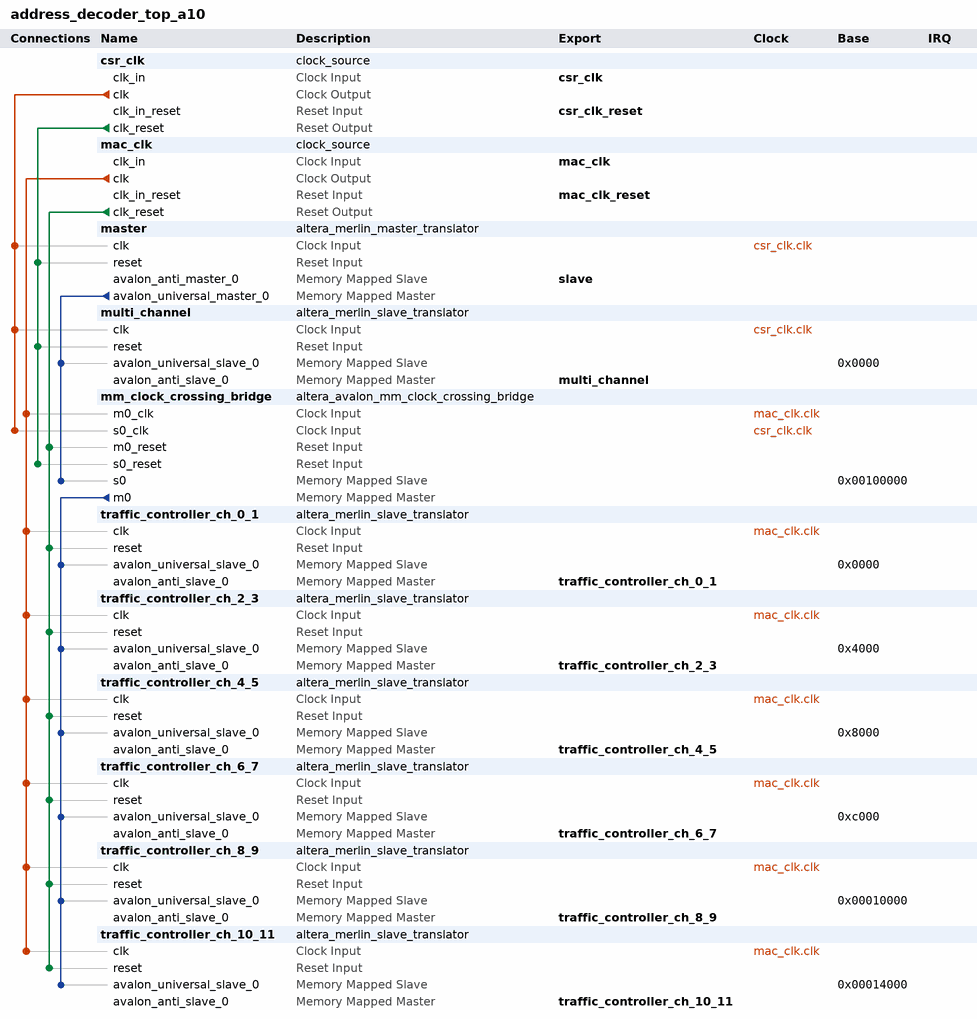
[diagram p0: system contents]
# Platform Designer (Qsys) system address_decoder_top_a10, Arria 10 10AX115S4F45I3SGE2
# Parameters at their usual value, and those the tool derives, are not listed.
package require -exact qsys 16.0
create_system address_decoder_top_a10
set_project_property DEVICE_FAMILY {Arria 10}
set_project_property DEVICE 10AX115S4F45I3SGE2

add_instance csr_clk clock_source 16.0
set_instance_parameter_value csr_clk clockFrequency 125000000

add_instance mac_clk clock_source 16.0
set_instance_parameter_value mac_clk clockFrequency 156250000

add_instance master altera_merlin_master_translator 16.0
set_instance_parameter_value master AV_ADDRESSGROUP 0
set_instance_parameter_value master AV_ADDRESS_SYMBOLS 1
set_instance_parameter_value master AV_ADDRESS_W 26
set_instance_parameter_value master AV_ALWAYSBURSTMAXBURST 0
set_instance_parameter_value master AV_BITS_PER_SYMBOL 8
set_instance_parameter_value master AV_BURSTBOUNDARIES 0
set_instance_parameter_value master AV_BURSTCOUNT_SYMBOLS 1
set_instance_parameter_value master AV_BURSTCOUNT_W 3
set_instance_parameter_value master AV_BYTEENABLE_W 4
set_instance_parameter_value master AV_CONSTANT_BURST_BEHAVIOR 0
set_instance_parameter_value master AV_DATA_HOLD 0
set_instance_parameter_value master AV_DATA_W 32
set_instance_parameter_value master AV_INTERLEAVEBURSTS 0
set_instance_parameter_value master AV_ISBIGENDIAN 0
set_instance_parameter_value master AV_LINEWRAPBURSTS 0
set_instance_parameter_value master AV_MAX_PENDING_READ_TRANSACTIONS 1
set_instance_parameter_value master AV_READLATENCY 0
set_instance_parameter_value master AV_READ_WAIT 0
set_instance_parameter_value master AV_REGISTERINCOMINGSIGNALS 0
set_instance_parameter_value master AV_REGISTEROUTGOINGSIGNALS 0
set_instance_parameter_value master AV_SETUP_WAIT 0
set_instance_parameter_value master AV_SYMBOLS_PER_WORD 4
set_instance_parameter_value master AV_WRITE_WAIT 0
set_instance_parameter_value master SYNC_RESET 0
set_instance_parameter_value master UAV_ADDRESSGROUP 0
set_instance_parameter_value master UAV_ADDRESS_W 32
set_instance_parameter_value master UAV_BURSTCOUNT_W 3
set_instance_parameter_value master UAV_CONSTANT_BURST_BEHAVIOR 0
set_instance_parameter_value master USE_ADDRESS 1
set_instance_parameter_value master USE_BEGINBURSTTRANSFER 0
set_instance_parameter_value master USE_BEGINTRANSFER 0
set_instance_parameter_value master USE_BURSTCOUNT 0
set_instance_parameter_value master USE_BYTEENABLE 0
set_instance_parameter_value master USE_CHIPSELECT 0
set_instance_parameter_value master USE_CLKEN 0
set_instance_parameter_value master USE_DEBUGACCESS 0
set_instance_parameter_value master USE_LOCK 0
set_instance_parameter_value master USE_READ 1
set_instance_parameter_value master USE_READDATA 1
set_instance_parameter_value master USE_READDATAVALID 1
set_instance_parameter_value master USE_READRESPONSE 0
set_instance_parameter_value master USE_WAITREQUEST 1
set_instance_parameter_value master USE_WRITE 1
set_instance_parameter_value master USE_WRITEDATA 1
set_instance_parameter_value master USE_WRITERESPONSE 0

add_instance multi_channel altera_merlin_slave_translator 16.0
set_instance_parameter_value multi_channel AV_ADDRESSGROUP 0
set_instance_parameter_value multi_channel AV_ADDRESS_SYMBOLS 1
set_instance_parameter_value multi_channel AV_ADDRESS_W 20
set_instance_parameter_value multi_channel AV_ALWAYSBURSTMAXBURST 0
set_instance_parameter_value multi_channel AV_BITS_PER_SYMBOL 8
set_instance_parameter_value multi_channel AV_BURSTBOUNDARIES 0
set_instance_parameter_value multi_channel AV_BURSTCOUNT_SYMBOLS 1
set_instance_parameter_value multi_channel AV_BURSTCOUNT_W 1
set_instance_parameter_value multi_channel AV_BYTEENABLE_W 4
set_instance_parameter_value multi_channel AV_CONSTANT_BURST_BEHAVIOR 0
set_instance_parameter_value multi_channel AV_DATA_HOLD 0
set_instance_parameter_value multi_channel AV_DATA_W 32
set_instance_parameter_value multi_channel AV_INTERLEAVEBURSTS 0
set_instance_parameter_value multi_channel AV_ISBIGENDIAN 0
set_instance_parameter_value multi_channel AV_LINEWRAPBURSTS 0
set_instance_parameter_value multi_channel AV_MAX_PENDING_READ_TRANSACTIONS 1
set_instance_parameter_value multi_channel AV_MAX_PENDING_WRITE_TRANSACTIONS 0
set_instance_parameter_value multi_channel AV_READLATENCY 0
set_instance_parameter_value multi_channel AV_READ_WAIT 0
set_instance_parameter_value multi_channel AV_REGISTERINCOMINGSIGNALS 0
set_instance_parameter_value multi_channel AV_REGISTEROUTGOINGSIGNALS 0
set_instance_parameter_value multi_channel AV_REQUIRE_UNALIGNED_ADDRESSES 0
set_instance_parameter_value multi_channel AV_SETUP_WAIT 0
set_instance_parameter_value multi_channel AV_SYMBOLS_PER_WORD 4
set_instance_parameter_value multi_channel AV_TIMING_UNITS 1
set_instance_parameter_value multi_channel AV_WRITE_WAIT 0
set_instance_parameter_value multi_channel CHIPSELECT_THROUGH_READLATENCY 0
set_instance_parameter_value multi_channel CLOCK_RATE 125000000
set_instance_parameter_value multi_channel UAV_ADDRESSGROUP 0
set_instance_parameter_value multi_channel UAV_ADDRESS_W 20
set_instance_parameter_value multi_channel UAV_BURSTCOUNT_W 3
set_instance_parameter_value multi_channel UAV_BYTEENABLE_W 4
set_instance_parameter_value multi_channel UAV_CONSTANT_BURST_BEHAVIOR 0
set_instance_parameter_value multi_channel UAV_DATA_W 32
set_instance_parameter_value multi_channel USE_ADDRESS 1
set_instance_parameter_value multi_channel USE_AV_CLKEN 0
set_instance_parameter_value multi_channel USE_BEGINBURSTTRANSFER 0
set_instance_parameter_value multi_channel USE_BEGINTRANSFER 0
set_instance_parameter_value multi_channel USE_BURSTCOUNT 0
set_instance_parameter_value multi_channel USE_BYTEENABLE 0
set_instance_parameter_value multi_channel USE_CHIPSELECT 0
set_instance_parameter_value multi_channel USE_DEBUGACCESS 0
set_instance_parameter_value multi_channel USE_LOCK 0
set_instance_parameter_value multi_channel USE_OUTPUTENABLE 0
set_instance_parameter_value multi_channel USE_READ 1
set_instance_parameter_value multi_channel USE_READDATA 1
set_instance_parameter_value multi_channel USE_READDATAVALID 0
set_instance_parameter_value multi_channel USE_READRESPONSE 0
set_instance_parameter_value multi_channel USE_UAV_CLKEN 0
set_instance_parameter_value multi_channel USE_WAITREQUEST 1
set_instance_parameter_value multi_channel USE_WRITE 1
set_instance_parameter_value multi_channel USE_WRITEBYTEENABLE 0
set_instance_parameter_value multi_channel USE_WRITEDATA 1
set_instance_parameter_value multi_channel USE_WRITERESPONSE 0

add_instance mm_clock_crossing_bridge altera_avalon_mm_clock_crossing_bridge 16.0
set_instance_parameter_value mm_clock_crossing_bridge ADDRESS_WIDTH 20
set_instance_parameter_value mm_clock_crossing_bridge COMMAND_FIFO_DEPTH 4
set_instance_parameter_value mm_clock_crossing_bridge DATA_WIDTH 32
set_instance_parameter_value mm_clock_crossing_bridge MASTER_SYNC_DEPTH 3
set_instance_parameter_value mm_clock_crossing_bridge MAX_BURST_SIZE 1
set_instance_parameter_value mm_clock_crossing_bridge RESPONSE_FIFO_DEPTH 4
set_instance_parameter_value mm_clock_crossing_bridge SLAVE_SYNC_DEPTH 3
set_instance_parameter_value mm_clock_crossing_bridge USE_AUTO_ADDRESS_WIDTH 1

add_instance traffic_controller_ch_0_1 altera_merlin_slave_translator 16.0
set_instance_parameter_value traffic_controller_ch_0_1 AV_ADDRESSGROUP 0
set_instance_parameter_value traffic_controller_ch_0_1 AV_ADDRESS_SYMBOLS 1
set_instance_parameter_value traffic_controller_ch_0_1 AV_ADDRESS_W 14
set_instance_parameter_value traffic_controller_ch_0_1 AV_ALWAYSBURSTMAXBURST 0
set_instance_parameter_value traffic_controller_ch_0_1 AV_BITS_PER_SYMBOL 8
set_instance_parameter_value traffic_controller_ch_0_1 AV_BURSTBOUNDARIES 0
set_instance_parameter_value traffic_controller_ch_0_1 AV_BURSTCOUNT_SYMBOLS 1
set_instance_parameter_value traffic_controller_ch_0_1 AV_BURSTCOUNT_W 1
set_instance_parameter_value traffic_controller_ch_0_1 AV_BYTEENABLE_W 4
set_instance_parameter_value traffic_controller_ch_0_1 AV_CONSTANT_BURST_BEHAVIOR 0
set_instance_parameter_value traffic_controller_ch_0_1 AV_DATA_HOLD 0
set_instance_parameter_value traffic_controller_ch_0_1 AV_DATA_W 32
set_instance_parameter_value traffic_controller_ch_0_1 AV_INTERLEAVEBURSTS 0
set_instance_parameter_value traffic_controller_ch_0_1 AV_ISBIGENDIAN 0
set_instance_parameter_value traffic_controller_ch_0_1 AV_LINEWRAPBURSTS 0
set_instance_parameter_value traffic_controller_ch_0_1 AV_MAX_PENDING_READ_TRANSACTIONS 1
set_instance_parameter_value traffic_controller_ch_0_1 AV_MAX_PENDING_WRITE_TRANSACTIONS 0
set_instance_parameter_value traffic_controller_ch_0_1 AV_READLATENCY 0
set_instance_parameter_value traffic_controller_ch_0_1 AV_READ_WAIT 0
set_instance_parameter_value traffic_controller_ch_0_1 AV_REGISTERINCOMINGSIGNALS 0
set_instance_parameter_value traffic_controller_ch_0_1 AV_REGISTEROUTGOINGSIGNALS 0
set_instance_parameter_value traffic_controller_ch_0_1 AV_REQUIRE_UNALIGNED_ADDRESSES 0
set_instance_parameter_value traffic_controller_ch_0_1 AV_SETUP_WAIT 0
set_instance_parameter_value traffic_controller_ch_0_1 AV_SYMBOLS_PER_WORD 4
set_instance_parameter_value traffic_controller_ch_0_1 AV_TIMING_UNITS 1
set_instance_parameter_value traffic_controller_ch_0_1 AV_WRITE_WAIT 0
set_instance_parameter_value traffic_controller_ch_0_1 CHIPSELECT_THROUGH_READLATENCY 0
set_instance_parameter_value traffic_controller_ch_0_1 CLOCK_RATE 156250000
set_instance_parameter_value traffic_controller_ch_0_1 UAV_ADDRESSGROUP 0
set_instance_parameter_value traffic_controller_ch_0_1 UAV_ADDRESS_W 14
set_instance_parameter_value traffic_controller_ch_0_1 UAV_BURSTCOUNT_W 3
set_instance_parameter_value traffic_controller_ch_0_1 UAV_BYTEENABLE_W 4
set_instance_parameter_value traffic_controller_ch_0_1 UAV_CONSTANT_BURST_BEHAVIOR 0
set_instance_parameter_value traffic_controller_ch_0_1 UAV_DATA_W 32
set_instance_parameter_value traffic_controller_ch_0_1 USE_ADDRESS 1
set_instance_parameter_value traffic_controller_ch_0_1 USE_AV_CLKEN 0
set_instance_parameter_value traffic_controller_ch_0_1 USE_BEGINBURSTTRANSFER 0
set_instance_parameter_value traffic_controller_ch_0_1 USE_BEGINTRANSFER 0
set_instance_parameter_value traffic_controller_ch_0_1 USE_BURSTCOUNT 0
set_instance_parameter_value traffic_controller_ch_0_1 USE_BYTEENABLE 0
set_instance_parameter_value traffic_controller_ch_0_1 USE_CHIPSELECT 0
set_instance_parameter_value traffic_controller_ch_0_1 USE_DEBUGACCESS 0
set_instance_parameter_value traffic_controller_ch_0_1 USE_LOCK 0
set_instance_parameter_value traffic_controller_ch_0_1 USE_OUTPUTENABLE 0
set_instance_parameter_value traffic_controller_ch_0_1 USE_READ 1
set_instance_parameter_value traffic_controller_ch_0_1 USE_READDATA 1
set_instance_parameter_value traffic_controller_ch_0_1 USE_READDATAVALID 0
set_instance_parameter_value traffic_controller_ch_0_1 USE_READRESPONSE 0
set_instance_parameter_value traffic_controller_ch_0_1 USE_UAV_CLKEN 0
set_instance_parameter_value traffic_controller_ch_0_1 USE_WAITREQUEST 1
set_instance_parameter_value traffic_controller_ch_0_1 USE_WRITE 1
set_instance_parameter_value traffic_controller_ch_0_1 USE_WRITEBYTEENABLE 0
set_instance_parameter_value traffic_controller_ch_0_1 USE_WRITEDATA 1
set_instance_parameter_value traffic_controller_ch_0_1 USE_WRITERESPONSE 0

add_instance traffic_controller_ch_2_3 altera_merlin_slave_translator 16.0
set_instance_parameter_value traffic_controller_ch_2_3 AV_ADDRESSGROUP 0
set_instance_parameter_value traffic_controller_ch_2_3 AV_ADDRESS_SYMBOLS 1
set_instance_parameter_value traffic_controller_ch_2_3 AV_ADDRESS_W 14
set_instance_parameter_value traffic_controller_ch_2_3 AV_ALWAYSBURSTMAXBURST 0
set_instance_parameter_value traffic_controller_ch_2_3 AV_BITS_PER_SYMBOL 8
set_instance_parameter_value traffic_controller_ch_2_3 AV_BURSTBOUNDARIES 0
set_instance_parameter_value traffic_controller_ch_2_3 AV_BURSTCOUNT_SYMBOLS 1
set_instance_parameter_value traffic_controller_ch_2_3 AV_BURSTCOUNT_W 1
set_instance_parameter_value traffic_controller_ch_2_3 AV_BYTEENABLE_W 4
set_instance_parameter_value traffic_controller_ch_2_3 AV_CONSTANT_BURST_BEHAVIOR 0
set_instance_parameter_value traffic_controller_ch_2_3 AV_DATA_HOLD 0
set_instance_parameter_value traffic_controller_ch_2_3 AV_DATA_W 32
set_instance_parameter_value traffic_controller_ch_2_3 AV_INTERLEAVEBURSTS 0
set_instance_parameter_value traffic_controller_ch_2_3 AV_ISBIGENDIAN 0
set_instance_parameter_value traffic_controller_ch_2_3 AV_LINEWRAPBURSTS 0
set_instance_parameter_value traffic_controller_ch_2_3 AV_MAX_PENDING_READ_TRANSACTIONS 1
set_instance_parameter_value traffic_controller_ch_2_3 AV_MAX_PENDING_WRITE_TRANSACTIONS 0
set_instance_parameter_value traffic_controller_ch_2_3 AV_READLATENCY 0
set_instance_parameter_value traffic_controller_ch_2_3 AV_READ_WAIT 0
set_instance_parameter_value traffic_controller_ch_2_3 AV_REGISTERINCOMINGSIGNALS 0
set_instance_parameter_value traffic_controller_ch_2_3 AV_REGISTEROUTGOINGSIGNALS 0
set_instance_parameter_value traffic_controller_ch_2_3 AV_REQUIRE_UNALIGNED_ADDRESSES 0
set_instance_parameter_value traffic_controller_ch_2_3 AV_SETUP_WAIT 0
set_instance_parameter_value traffic_controller_ch_2_3 AV_SYMBOLS_PER_WORD 4
set_instance_parameter_value traffic_controller_ch_2_3 AV_TIMING_UNITS 1
set_instance_parameter_value traffic_controller_ch_2_3 AV_WRITE_WAIT 0
set_instance_parameter_value traffic_controller_ch_2_3 CHIPSELECT_THROUGH_READLATENCY 0
set_instance_parameter_value traffic_controller_ch_2_3 CLOCK_RATE 156250000
set_instance_parameter_value traffic_controller_ch_2_3 UAV_ADDRESSGROUP 0
set_instance_parameter_value traffic_controller_ch_2_3 UAV_ADDRESS_W 14
set_instance_parameter_value traffic_controller_ch_2_3 UAV_BURSTCOUNT_W 3
set_instance_parameter_value traffic_controller_ch_2_3 UAV_BYTEENABLE_W 4
set_instance_parameter_value traffic_controller_ch_2_3 UAV_CONSTANT_BURST_BEHAVIOR 0
set_instance_parameter_value traffic_controller_ch_2_3 UAV_DATA_W 32
set_instance_parameter_value traffic_controller_ch_2_3 USE_ADDRESS 1
set_instance_parameter_value traffic_controller_ch_2_3 USE_AV_CLKEN 0
set_instance_parameter_value traffic_controller_ch_2_3 USE_BEGINBURSTTRANSFER 0
set_instance_parameter_value traffic_controller_ch_2_3 USE_BEGINTRANSFER 0
set_instance_parameter_value traffic_controller_ch_2_3 USE_BURSTCOUNT 0
set_instance_parameter_value traffic_controller_ch_2_3 USE_BYTEENABLE 0
set_instance_parameter_value traffic_controller_ch_2_3 USE_CHIPSELECT 0
set_instance_parameter_value traffic_controller_ch_2_3 USE_DEBUGACCESS 0
set_instance_parameter_value traffic_controller_ch_2_3 USE_LOCK 0
set_instance_parameter_value traffic_controller_ch_2_3 USE_OUTPUTENABLE 0
set_instance_parameter_value traffic_controller_ch_2_3 USE_READ 1
set_instance_parameter_value traffic_controller_ch_2_3 USE_READDATA 1
set_instance_parameter_value traffic_controller_ch_2_3 USE_READDATAVALID 0
set_instance_parameter_value traffic_controller_ch_2_3 USE_READRESPONSE 0
set_instance_parameter_value traffic_controller_ch_2_3 USE_UAV_CLKEN 0
set_instance_parameter_value traffic_controller_ch_2_3 USE_WAITREQUEST 1
set_instance_parameter_value traffic_controller_ch_2_3 USE_WRITE 1
set_instance_parameter_value traffic_controller_ch_2_3 USE_WRITEBYTEENABLE 0
set_instance_parameter_value traffic_controller_ch_2_3 USE_WRITEDATA 1
set_instance_parameter_value traffic_controller_ch_2_3 USE_WRITERESPONSE 0

add_instance traffic_controller_ch_4_5 altera_merlin_slave_translator 16.0
set_instance_parameter_value traffic_controller_ch_4_5 AV_ADDRESSGROUP 0
set_instance_parameter_value traffic_controller_ch_4_5 AV_ADDRESS_SYMBOLS 1
set_instance_parameter_value traffic_controller_ch_4_5 AV_ADDRESS_W 14
set_instance_parameter_value traffic_controller_ch_4_5 AV_ALWAYSBURSTMAXBURST 0
set_instance_parameter_value traffic_controller_ch_4_5 AV_BITS_PER_SYMBOL 8
set_instance_parameter_value traffic_controller_ch_4_5 AV_BURSTBOUNDARIES 0
set_instance_parameter_value traffic_controller_ch_4_5 AV_BURSTCOUNT_SYMBOLS 1
set_instance_parameter_value traffic_controller_ch_4_5 AV_BURSTCOUNT_W 1
set_instance_parameter_value traffic_controller_ch_4_5 AV_BYTEENABLE_W 4
set_instance_parameter_value traffic_controller_ch_4_5 AV_CONSTANT_BURST_BEHAVIOR 0
set_instance_parameter_value traffic_controller_ch_4_5 AV_DATA_HOLD 0
set_instance_parameter_value traffic_controller_ch_4_5 AV_DATA_W 32
set_instance_parameter_value traffic_controller_ch_4_5 AV_INTERLEAVEBURSTS 0
set_instance_parameter_value traffic_controller_ch_4_5 AV_ISBIGENDIAN 0
set_instance_parameter_value traffic_controller_ch_4_5 AV_LINEWRAPBURSTS 0
set_instance_parameter_value traffic_controller_ch_4_5 AV_MAX_PENDING_READ_TRANSACTIONS 1
set_instance_parameter_value traffic_controller_ch_4_5 AV_MAX_PENDING_WRITE_TRANSACTIONS 0
set_instance_parameter_value traffic_controller_ch_4_5 AV_READLATENCY 0
set_instance_parameter_value traffic_controller_ch_4_5 AV_READ_WAIT 0
set_instance_parameter_value traffic_controller_ch_4_5 AV_REGISTERINCOMINGSIGNALS 0
set_instance_parameter_value traffic_controller_ch_4_5 AV_REGISTEROUTGOINGSIGNALS 0
set_instance_parameter_value traffic_controller_ch_4_5 AV_REQUIRE_UNALIGNED_ADDRESSES 0
set_instance_parameter_value traffic_controller_ch_4_5 AV_SETUP_WAIT 0
set_instance_parameter_value traffic_controller_ch_4_5 AV_SYMBOLS_PER_WORD 4
set_instance_parameter_value traffic_controller_ch_4_5 AV_TIMING_UNITS 1
set_instance_parameter_value traffic_controller_ch_4_5 AV_WRITE_WAIT 0
set_instance_parameter_value traffic_controller_ch_4_5 CHIPSELECT_THROUGH_READLATENCY 0
set_instance_parameter_value traffic_controller_ch_4_5 CLOCK_RATE 156250000
set_instance_parameter_value traffic_controller_ch_4_5 UAV_ADDRESSGROUP 0
set_instance_parameter_value traffic_controller_ch_4_5 UAV_ADDRESS_W 14
set_instance_parameter_value traffic_controller_ch_4_5 UAV_BURSTCOUNT_W 3
set_instance_parameter_value traffic_controller_ch_4_5 UAV_BYTEENABLE_W 4
set_instance_parameter_value traffic_controller_ch_4_5 UAV_CONSTANT_BURST_BEHAVIOR 0
set_instance_parameter_value traffic_controller_ch_4_5 UAV_DATA_W 32
set_instance_parameter_value traffic_controller_ch_4_5 USE_ADDRESS 1
set_instance_parameter_value traffic_controller_ch_4_5 USE_AV_CLKEN 0
set_instance_parameter_value traffic_controller_ch_4_5 USE_BEGINBURSTTRANSFER 0
set_instance_parameter_value traffic_controller_ch_4_5 USE_BEGINTRANSFER 0
set_instance_parameter_value traffic_controller_ch_4_5 USE_BURSTCOUNT 0
set_instance_parameter_value traffic_controller_ch_4_5 USE_BYTEENABLE 0
set_instance_parameter_value traffic_controller_ch_4_5 USE_CHIPSELECT 0
set_instance_parameter_value traffic_controller_ch_4_5 USE_DEBUGACCESS 0
set_instance_parameter_value traffic_controller_ch_4_5 USE_LOCK 0
set_instance_parameter_value traffic_controller_ch_4_5 USE_OUTPUTENABLE 0
set_instance_parameter_value traffic_controller_ch_4_5 USE_READ 1
set_instance_parameter_value traffic_controller_ch_4_5 USE_READDATA 1
set_instance_parameter_value traffic_controller_ch_4_5 USE_READDATAVALID 0
set_instance_parameter_value traffic_controller_ch_4_5 USE_READRESPONSE 0
set_instance_parameter_value traffic_controller_ch_4_5 USE_UAV_CLKEN 0
set_instance_parameter_value traffic_controller_ch_4_5 USE_WAITREQUEST 1
set_instance_parameter_value traffic_controller_ch_4_5 USE_WRITE 1
set_instance_parameter_value traffic_controller_ch_4_5 USE_WRITEBYTEENABLE 0
set_instance_parameter_value traffic_controller_ch_4_5 USE_WRITEDATA 1
set_instance_parameter_value traffic_controller_ch_4_5 USE_WRITERESPONSE 0

add_instance traffic_controller_ch_6_7 altera_merlin_slave_translator 16.0
set_instance_parameter_value traffic_controller_ch_6_7 AV_ADDRESSGROUP 0
set_instance_parameter_value traffic_controller_ch_6_7 AV_ADDRESS_SYMBOLS 1
set_instance_parameter_value traffic_controller_ch_6_7 AV_ADDRESS_W 14
set_instance_parameter_value traffic_controller_ch_6_7 AV_ALWAYSBURSTMAXBURST 0
set_instance_parameter_value traffic_controller_ch_6_7 AV_BITS_PER_SYMBOL 8
set_instance_parameter_value traffic_controller_ch_6_7 AV_BURSTBOUNDARIES 0
set_instance_parameter_value traffic_controller_ch_6_7 AV_BURSTCOUNT_SYMBOLS 1
set_instance_parameter_value traffic_controller_ch_6_7 AV_BURSTCOUNT_W 1
set_instance_parameter_value traffic_controller_ch_6_7 AV_BYTEENABLE_W 4
set_instance_parameter_value traffic_controller_ch_6_7 AV_CONSTANT_BURST_BEHAVIOR 0
set_instance_parameter_value traffic_controller_ch_6_7 AV_DATA_HOLD 0
set_instance_parameter_value traffic_controller_ch_6_7 AV_DATA_W 32
set_instance_parameter_value traffic_controller_ch_6_7 AV_INTERLEAVEBURSTS 0
set_instance_parameter_value traffic_controller_ch_6_7 AV_ISBIGENDIAN 0
set_instance_parameter_value traffic_controller_ch_6_7 AV_LINEWRAPBURSTS 0
set_instance_parameter_value traffic_controller_ch_6_7 AV_MAX_PENDING_READ_TRANSACTIONS 1
set_instance_parameter_value traffic_controller_ch_6_7 AV_MAX_PENDING_WRITE_TRANSACTIONS 0
set_instance_parameter_value traffic_controller_ch_6_7 AV_READLATENCY 0
set_instance_parameter_value traffic_controller_ch_6_7 AV_READ_WAIT 0
set_instance_parameter_value traffic_controller_ch_6_7 AV_REGISTERINCOMINGSIGNALS 0
set_instance_parameter_value traffic_controller_ch_6_7 AV_REGISTEROUTGOINGSIGNALS 0
set_instance_parameter_value traffic_controller_ch_6_7 AV_REQUIRE_UNALIGNED_ADDRESSES 0
set_instance_parameter_value traffic_controller_ch_6_7 AV_SETUP_WAIT 0
set_instance_parameter_value traffic_controller_ch_6_7 AV_SYMBOLS_PER_WORD 4
set_instance_parameter_value traffic_controller_ch_6_7 AV_TIMING_UNITS 1
set_instance_parameter_value traffic_controller_ch_6_7 AV_WRITE_WAIT 0
set_instance_parameter_value traffic_controller_ch_6_7 CHIPSELECT_THROUGH_READLATENCY 0
set_instance_parameter_value traffic_controller_ch_6_7 CLOCK_RATE 156250000
set_instance_parameter_value traffic_controller_ch_6_7 UAV_ADDRESSGROUP 0
set_instance_parameter_value traffic_controller_ch_6_7 UAV_ADDRESS_W 14
set_instance_parameter_value traffic_controller_ch_6_7 UAV_BURSTCOUNT_W 3
set_instance_parameter_value traffic_controller_ch_6_7 UAV_BYTEENABLE_W 4
set_instance_parameter_value traffic_controller_ch_6_7 UAV_CONSTANT_BURST_BEHAVIOR 0
set_instance_parameter_value traffic_controller_ch_6_7 UAV_DATA_W 32
set_instance_parameter_value traffic_controller_ch_6_7 USE_ADDRESS 1
set_instance_parameter_value traffic_controller_ch_6_7 USE_AV_CLKEN 0
set_instance_parameter_value traffic_controller_ch_6_7 USE_BEGINBURSTTRANSFER 0
set_instance_parameter_value traffic_controller_ch_6_7 USE_BEGINTRANSFER 0
set_instance_parameter_value traffic_controller_ch_6_7 USE_BURSTCOUNT 0
set_instance_parameter_value traffic_controller_ch_6_7 USE_BYTEENABLE 0
set_instance_parameter_value traffic_controller_ch_6_7 USE_CHIPSELECT 0
set_instance_parameter_value traffic_controller_ch_6_7 USE_DEBUGACCESS 0
set_instance_parameter_value traffic_controller_ch_6_7 USE_LOCK 0
set_instance_parameter_value traffic_controller_ch_6_7 USE_OUTPUTENABLE 0
set_instance_parameter_value traffic_controller_ch_6_7 USE_READ 1
set_instance_parameter_value traffic_controller_ch_6_7 USE_READDATA 1
set_instance_parameter_value traffic_controller_ch_6_7 USE_READDATAVALID 0
set_instance_parameter_value traffic_controller_ch_6_7 USE_READRESPONSE 0
set_instance_parameter_value traffic_controller_ch_6_7 USE_UAV_CLKEN 0
set_instance_parameter_value traffic_controller_ch_6_7 USE_WAITREQUEST 1
set_instance_parameter_value traffic_controller_ch_6_7 USE_WRITE 1
set_instance_parameter_value traffic_controller_ch_6_7 USE_WRITEBYTEENABLE 0
set_instance_parameter_value traffic_controller_ch_6_7 USE_WRITEDATA 1
set_instance_parameter_value traffic_controller_ch_6_7 USE_WRITERESPONSE 0

add_instance traffic_controller_ch_8_9 altera_merlin_slave_translator 16.0
set_instance_parameter_value traffic_controller_ch_8_9 AV_ADDRESSGROUP 0
set_instance_parameter_value traffic_controller_ch_8_9 AV_ADDRESS_SYMBOLS 1
set_instance_parameter_value traffic_controller_ch_8_9 AV_ADDRESS_W 14
set_instance_parameter_value traffic_controller_ch_8_9 AV_ALWAYSBURSTMAXBURST 0
set_instance_parameter_value traffic_controller_ch_8_9 AV_BITS_PER_SYMBOL 8
set_instance_parameter_value traffic_controller_ch_8_9 AV_BURSTBOUNDARIES 0
set_instance_parameter_value traffic_controller_ch_8_9 AV_BURSTCOUNT_SYMBOLS 1
set_instance_parameter_value traffic_controller_ch_8_9 AV_BURSTCOUNT_W 1
set_instance_parameter_value traffic_controller_ch_8_9 AV_BYTEENABLE_W 4
set_instance_parameter_value traffic_controller_ch_8_9 AV_CONSTANT_BURST_BEHAVIOR 0
set_instance_parameter_value traffic_controller_ch_8_9 AV_DATA_HOLD 0
set_instance_parameter_value traffic_controller_ch_8_9 AV_DATA_W 32
set_instance_parameter_value traffic_controller_ch_8_9 AV_INTERLEAVEBURSTS 0
set_instance_parameter_value traffic_controller_ch_8_9 AV_ISBIGENDIAN 0
set_instance_parameter_value traffic_controller_ch_8_9 AV_LINEWRAPBURSTS 0
set_instance_parameter_value traffic_controller_ch_8_9 AV_MAX_PENDING_READ_TRANSACTIONS 1
set_instance_parameter_value traffic_controller_ch_8_9 AV_MAX_PENDING_WRITE_TRANSACTIONS 0
set_instance_parameter_value traffic_controller_ch_8_9 AV_READLATENCY 0
set_instance_parameter_value traffic_controller_ch_8_9 AV_READ_WAIT 0
set_instance_parameter_value traffic_controller_ch_8_9 AV_REGISTERINCOMINGSIGNALS 0
set_instance_parameter_value traffic_controller_ch_8_9 AV_REGISTEROUTGOINGSIGNALS 0
set_instance_parameter_value traffic_controller_ch_8_9 AV_REQUIRE_UNALIGNED_ADDRESSES 0
set_instance_parameter_value traffic_controller_ch_8_9 AV_SETUP_WAIT 0
set_instance_parameter_value traffic_controller_ch_8_9 AV_SYMBOLS_PER_WORD 4
set_instance_parameter_value traffic_controller_ch_8_9 AV_TIMING_UNITS 1
set_instance_parameter_value traffic_controller_ch_8_9 AV_WRITE_WAIT 0
set_instance_parameter_value traffic_controller_ch_8_9 CHIPSELECT_THROUGH_READLATENCY 0
set_instance_parameter_value traffic_controller_ch_8_9 CLOCK_RATE 156250000
set_instance_parameter_value traffic_controller_ch_8_9 UAV_ADDRESSGROUP 0
set_instance_parameter_value traffic_controller_ch_8_9 UAV_ADDRESS_W 14
set_instance_parameter_value traffic_controller_ch_8_9 UAV_BURSTCOUNT_W 3
set_instance_parameter_value traffic_controller_ch_8_9 UAV_BYTEENABLE_W 4
set_instance_parameter_value traffic_controller_ch_8_9 UAV_CONSTANT_BURST_BEHAVIOR 0
set_instance_parameter_value traffic_controller_ch_8_9 UAV_DATA_W 32
set_instance_parameter_value traffic_controller_ch_8_9 USE_ADDRESS 1
set_instance_parameter_value traffic_controller_ch_8_9 USE_AV_CLKEN 0
set_instance_parameter_value traffic_controller_ch_8_9 USE_BEGINBURSTTRANSFER 0
set_instance_parameter_value traffic_controller_ch_8_9 USE_BEGINTRANSFER 0
set_instance_parameter_value traffic_controller_ch_8_9 USE_BURSTCOUNT 0
set_instance_parameter_value traffic_controller_ch_8_9 USE_BYTEENABLE 0
set_instance_parameter_value traffic_controller_ch_8_9 USE_CHIPSELECT 0
set_instance_parameter_value traffic_controller_ch_8_9 USE_DEBUGACCESS 0
set_instance_parameter_value traffic_controller_ch_8_9 USE_LOCK 0
set_instance_parameter_value traffic_controller_ch_8_9 USE_OUTPUTENABLE 0
set_instance_parameter_value traffic_controller_ch_8_9 USE_READ 1
set_instance_parameter_value traffic_controller_ch_8_9 USE_READDATA 1
set_instance_parameter_value traffic_controller_ch_8_9 USE_READDATAVALID 0
set_instance_parameter_value traffic_controller_ch_8_9 USE_READRESPONSE 0
set_instance_parameter_value traffic_controller_ch_8_9 USE_UAV_CLKEN 0
set_instance_parameter_value traffic_controller_ch_8_9 USE_WAITREQUEST 1
set_instance_parameter_value traffic_controller_ch_8_9 USE_WRITE 1
set_instance_parameter_value traffic_controller_ch_8_9 USE_WRITEBYTEENABLE 0
set_instance_parameter_value traffic_controller_ch_8_9 USE_WRITEDATA 1
set_instance_parameter_value traffic_controller_ch_8_9 USE_WRITERESPONSE 0

add_instance traffic_controller_ch_10_11 altera_merlin_slave_translator 16.0
set_instance_parameter_value traffic_controller_ch_10_11 AV_ADDRESSGROUP 0
set_instance_parameter_value traffic_controller_ch_10_11 AV_ADDRESS_SYMBOLS 1
set_instance_parameter_value traffic_controller_ch_10_11 AV_ADDRESS_W 14
set_instance_parameter_value traffic_controller_ch_10_11 AV_ALWAYSBURSTMAXBURST 0
set_instance_parameter_value traffic_controller_ch_10_11 AV_BITS_PER_SYMBOL 8
set_instance_parameter_value traffic_controller_ch_10_11 AV_BURSTBOUNDARIES 0
set_instance_parameter_value traffic_controller_ch_10_11 AV_BURSTCOUNT_SYMBOLS 1
set_instance_parameter_value traffic_controller_ch_10_11 AV_BURSTCOUNT_W 1
set_instance_parameter_value traffic_controller_ch_10_11 AV_BYTEENABLE_W 4
set_instance_parameter_value traffic_controller_ch_10_11 AV_CONSTANT_BURST_BEHAVIOR 0
set_instance_parameter_value traffic_controller_ch_10_11 AV_DATA_HOLD 0
set_instance_parameter_value traffic_controller_ch_10_11 AV_DATA_W 32
set_instance_parameter_value traffic_controller_ch_10_11 AV_INTERLEAVEBURSTS 0
set_instance_parameter_value traffic_controller_ch_10_11 AV_ISBIGENDIAN 0
set_instance_parameter_value traffic_controller_ch_10_11 AV_LINEWRAPBURSTS 0
set_instance_parameter_value traffic_controller_ch_10_11 AV_MAX_PENDING_READ_TRANSACTIONS 1
set_instance_parameter_value traffic_controller_ch_10_11 AV_MAX_PENDING_WRITE_TRANSACTIONS 0
set_instance_parameter_value traffic_controller_ch_10_11 AV_READLATENCY 0
set_instance_parameter_value traffic_controller_ch_10_11 AV_READ_WAIT 0
set_instance_parameter_value traffic_controller_ch_10_11 AV_REGISTERINCOMINGSIGNALS 0
set_instance_parameter_value traffic_controller_ch_10_11 AV_REGISTEROUTGOINGSIGNALS 0
set_instance_parameter_value traffic_controller_ch_10_11 AV_REQUIRE_UNALIGNED_ADDRESSES 0
set_instance_parameter_value traffic_controller_ch_10_11 AV_SETUP_WAIT 0
set_instance_parameter_value traffic_controller_ch_10_11 AV_SYMBOLS_PER_WORD 4
set_instance_parameter_value traffic_controller_ch_10_11 AV_TIMING_UNITS 1
set_instance_parameter_value traffic_controller_ch_10_11 AV_WRITE_WAIT 0
set_instance_parameter_value traffic_controller_ch_10_11 CHIPSELECT_THROUGH_READLATENCY 0
set_instance_parameter_value traffic_controller_ch_10_11 CLOCK_RATE 156250000
set_instance_parameter_value traffic_controller_ch_10_11 UAV_ADDRESSGROUP 0
set_instance_parameter_value traffic_controller_ch_10_11 UAV_ADDRESS_W 14
set_instance_parameter_value traffic_controller_ch_10_11 UAV_BURSTCOUNT_W 3
set_instance_parameter_value traffic_controller_ch_10_11 UAV_BYTEENABLE_W 4
set_instance_parameter_value traffic_controller_ch_10_11 UAV_CONSTANT_BURST_BEHAVIOR 0
set_instance_parameter_value traffic_controller_ch_10_11 UAV_DATA_W 32
set_instance_parameter_value traffic_controller_ch_10_11 USE_ADDRESS 1
set_instance_parameter_value traffic_controller_ch_10_11 USE_AV_CLKEN 0
set_instance_parameter_value traffic_controller_ch_10_11 USE_BEGINBURSTTRANSFER 0
set_instance_parameter_value traffic_controller_ch_10_11 USE_BEGINTRANSFER 0
set_instance_parameter_value traffic_controller_ch_10_11 USE_BURSTCOUNT 0
set_instance_parameter_value traffic_controller_ch_10_11 USE_BYTEENABLE 0
set_instance_parameter_value traffic_controller_ch_10_11 USE_CHIPSELECT 0
set_instance_parameter_value traffic_controller_ch_10_11 USE_DEBUGACCESS 0
set_instance_parameter_value traffic_controller_ch_10_11 USE_LOCK 0
set_instance_parameter_value traffic_controller_ch_10_11 USE_OUTPUTENABLE 0
set_instance_parameter_value traffic_controller_ch_10_11 USE_READ 1
set_instance_parameter_value traffic_controller_ch_10_11 USE_READDATA 1
set_instance_parameter_value traffic_controller_ch_10_11 USE_READDATAVALID 0
set_instance_parameter_value traffic_controller_ch_10_11 USE_READRESPONSE 0
set_instance_parameter_value traffic_controller_ch_10_11 USE_UAV_CLKEN 0
set_instance_parameter_value traffic_controller_ch_10_11 USE_WAITREQUEST 1
set_instance_parameter_value traffic_controller_ch_10_11 USE_WRITE 1
set_instance_parameter_value traffic_controller_ch_10_11 USE_WRITEBYTEENABLE 0
set_instance_parameter_value traffic_controller_ch_10_11 USE_WRITEDATA 1
set_instance_parameter_value traffic_controller_ch_10_11 USE_WRITERESPONSE 0

# connections
add_connection csr_clk.clk master.clk clock
add_connection csr_clk.clk mm_clock_crossing_bridge.s0_clk clock
add_connection csr_clk.clk multi_channel.clk clock
add_connection mac_clk.clk mm_clock_crossing_bridge.m0_clk clock
add_connection mac_clk.clk traffic_controller_ch_0_1.clk clock
add_connection mac_clk.clk traffic_controller_ch_2_3.clk clock
add_connection mac_clk.clk traffic_controller_ch_4_5.clk clock
add_connection mac_clk.clk traffic_controller_ch_6_7.clk clock
add_connection mac_clk.clk traffic_controller_ch_8_9.clk clock
add_connection mac_clk.clk traffic_controller_ch_10_11.clk clock
add_connection csr_clk.clk_reset master.reset reset
add_connection csr_clk.clk_reset mm_clock_crossing_bridge.s0_reset reset
add_connection csr_clk.clk_reset multi_channel.reset reset
add_connection mac_clk.clk_reset mm_clock_crossing_bridge.m0_reset reset
add_connection mac_clk.clk_reset traffic_controller_ch_0_1.reset reset
add_connection mac_clk.clk_reset traffic_controller_ch_2_3.reset reset
add_connection mac_clk.clk_reset traffic_controller_ch_4_5.reset reset
add_connection mac_clk.clk_reset traffic_controller_ch_6_7.reset reset
add_connection mac_clk.clk_reset traffic_controller_ch_8_9.reset reset
add_connection mac_clk.clk_reset traffic_controller_ch_10_11.reset reset
add_connection master.avalon_universal_master_0 mm_clock_crossing_bridge.s0 avalon
set_connection_parameter_value master.avalon_universal_master_0/mm_clock_crossing_bridge.s0 baseAddress 0x00100000
add_connection master.avalon_universal_master_0 multi_channel.avalon_universal_slave_0 avalon
set_connection_parameter_value master.avalon_universal_master_0/multi_channel.avalon_universal_slave_0 baseAddress 0x0000
add_connection mm_clock_crossing_bridge.m0 traffic_controller_ch_0_1.avalon_universal_slave_0 avalon
set_connection_parameter_value mm_clock_crossing_bridge.m0/traffic_controller_ch_0_1.avalon_universal_slave_0 baseAddress 0x0000
add_connection mm_clock_crossing_bridge.m0 traffic_controller_ch_2_3.avalon_universal_slave_0 avalon
set_connection_parameter_value mm_clock_crossing_bridge.m0/traffic_controller_ch_2_3.avalon_universal_slave_0 baseAddress 0x4000
add_connection mm_clock_crossing_bridge.m0 traffic_controller_ch_4_5.avalon_universal_slave_0 avalon
set_connection_parameter_value mm_clock_crossing_bridge.m0/traffic_controller_ch_4_5.avalon_universal_slave_0 baseAddress 0x8000
add_connection mm_clock_crossing_bridge.m0 traffic_controller_ch_6_7.avalon_universal_slave_0 avalon
set_connection_parameter_value mm_clock_crossing_bridge.m0/traffic_controller_ch_6_7.avalon_universal_slave_0 baseAddress 0xc000
add_connection mm_clock_crossing_bridge.m0 traffic_controller_ch_8_9.avalon_universal_slave_0 avalon
set_connection_parameter_value mm_clock_crossing_bridge.m0/traffic_controller_ch_8_9.avalon_universal_slave_0 baseAddress 0x00010000
add_connection mm_clock_crossing_bridge.m0 traffic_controller_ch_10_11.avalon_universal_slave_0 avalon
set_connection_parameter_value mm_clock_crossing_bridge.m0/traffic_controller_ch_10_11.avalon_universal_slave_0 baseAddress 0x00014000

# exported interfaces
add_interface csr_clk clock sink
set_interface_property csr_clk EXPORT_OF csr_clk.clk_in
add_interface csr_clk_reset reset sink
set_interface_property csr_clk_reset EXPORT_OF csr_clk.clk_in_reset
add_interface mac_clk clock sink
set_interface_property mac_clk EXPORT_OF mac_clk.clk_in
add_interface mac_clk_reset reset sink
set_interface_property mac_clk_reset EXPORT_OF mac_clk.clk_in_reset
add_interface multi_channel avalon master
set_interface_property multi_channel EXPORT_OF multi_channel.avalon_anti_slave_0
add_interface slave avalon slave
set_interface_property slave EXPORT_OF master.avalon_anti_master_0
add_interface traffic_controller_ch_0_1 avalon master
set_interface_property traffic_controller_ch_0_1 EXPORT_OF traffic_controller_ch_0_1.avalon_anti_slave_0
add_interface traffic_controller_ch_10_11 avalon master
set_interface_property traffic_controller_ch_10_11 EXPORT_OF traffic_controller_ch_10_11.avalon_anti_slave_0
add_interface traffic_controller_ch_2_3 avalon master
set_interface_property traffic_controller_ch_2_3 EXPORT_OF traffic_controller_ch_2_3.avalon_anti_slave_0
add_interface traffic_controller_ch_4_5 avalon master
set_interface_property traffic_controller_ch_4_5 EXPORT_OF traffic_controller_ch_4_5.avalon_anti_slave_0
add_interface traffic_controller_ch_6_7 avalon master
set_interface_property traffic_controller_ch_6_7 EXPORT_OF traffic_controller_ch_6_7.avalon_anti_slave_0
add_interface traffic_controller_ch_8_9 avalon master
set_interface_property traffic_controller_ch_8_9 EXPORT_OF traffic_controller_ch_8_9.avalon_anti_slave_0

set_interconnect_requirement {$system} qsys_mm.clockCrossingAdapter HANDSHAKE
set_interconnect_requirement {$system} qsys_mm.maxAdditionalLatency 1

save_system address_decoder_top_a10.qsys
